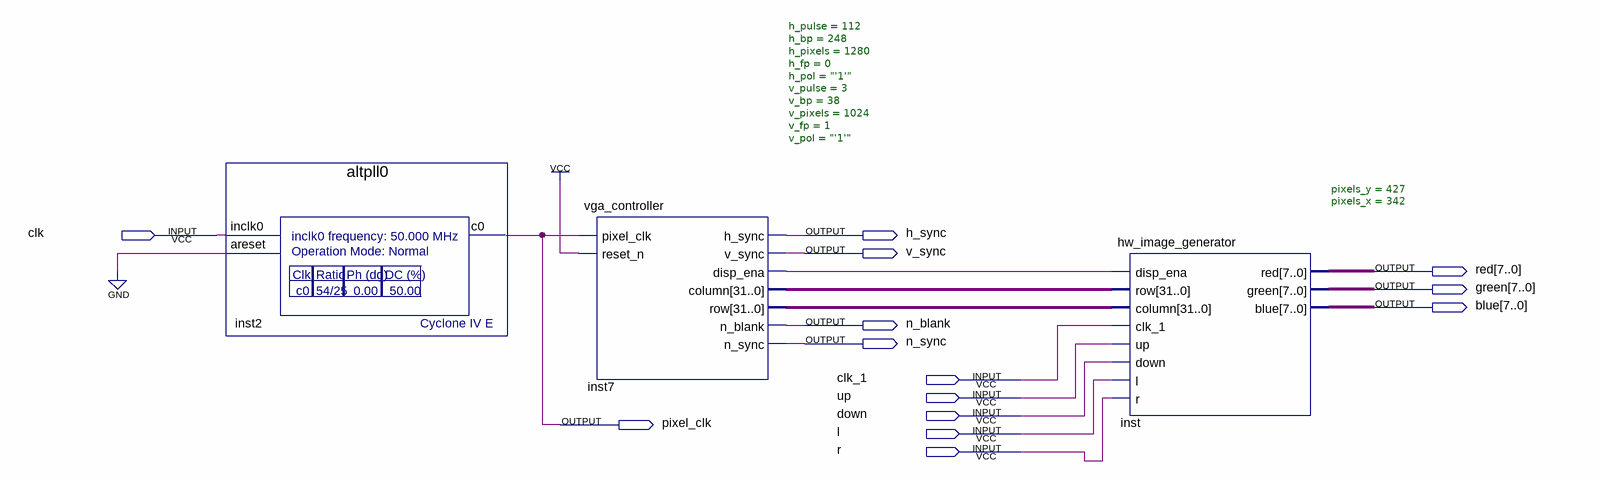
[diagram p0: schematic sheet]
// Quartus schematic vga_with_hw_test_image.bdf as structural Verilog: 3 symbols, 14 pins
module vga_with_hw_test_image (
  input  clk,
  input  clk_1,
  input  up,
  input  down,
  input  l,
  input  r,
  output h_sync,
  output v_sync,
  output [7:0] red,
  output [7:0] green,
  output [7:0] blue,
  output n_blank,
  output n_sync,
  output pixel_clk
);

  wire inst7_disp_ena;
  wire [31:0] inst7_column, inst7_row;

  altpll0 inst2 (.inclk0(clk), .areset(1'b0), .c0(pixel_clk));
  vga_controller #(.h_pulse(112), .h_bp(248), .h_pixels(1280), .h_fp(0), .h_pol("'1'"), .v_pulse(3), .v_bp(38), .v_pixels(1024), .v_fp(1), .v_pol("'1'")) inst7 (
    .pixel_clk(pixel_clk), .reset_n(1'b1), .h_sync(h_sync), .v_sync(v_sync), .disp_ena(inst7_disp_ena),
    .column(inst7_column), .row(inst7_row), .n_blank(n_blank), .n_sync(n_sync));
  hw_image_generator #(.pixels_y(427), .pixels_x(342)) inst (
    .disp_ena(inst7_disp_ena), .row(inst7_column), .column(inst7_row), .clk_1(clk_1), .up(up), .down(down),
    .l(l), .r(r), .red(red), .green(green), .blue(blue));
endmodule
